# Altium schematic sheet Actuators.SchDoc
size A2; SheetNumber: 3; SheetTotal: 4
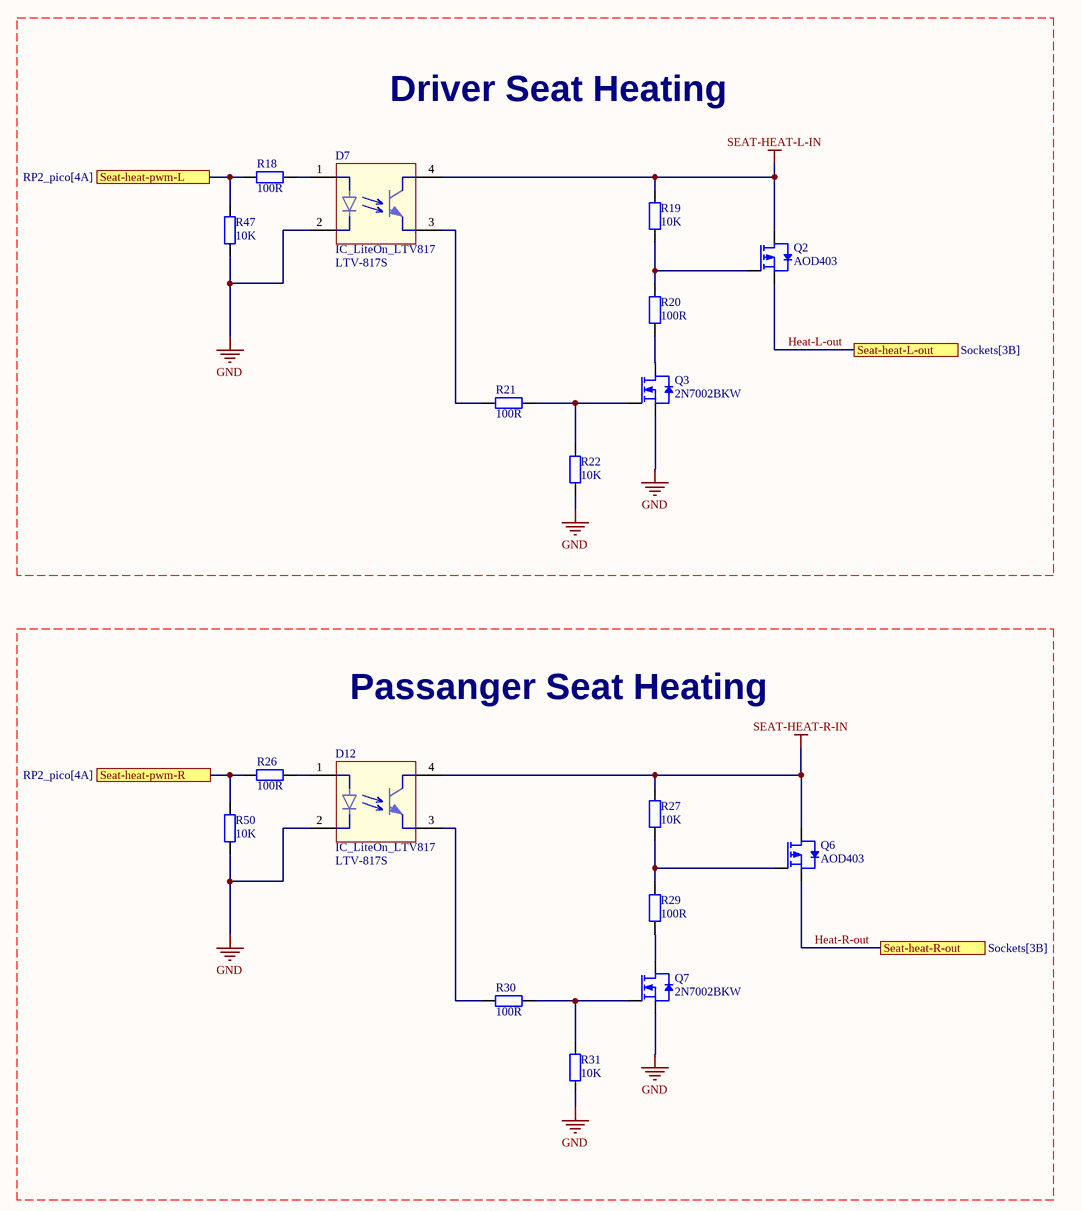
[diagram p0: Actuators.SchDoc, left]
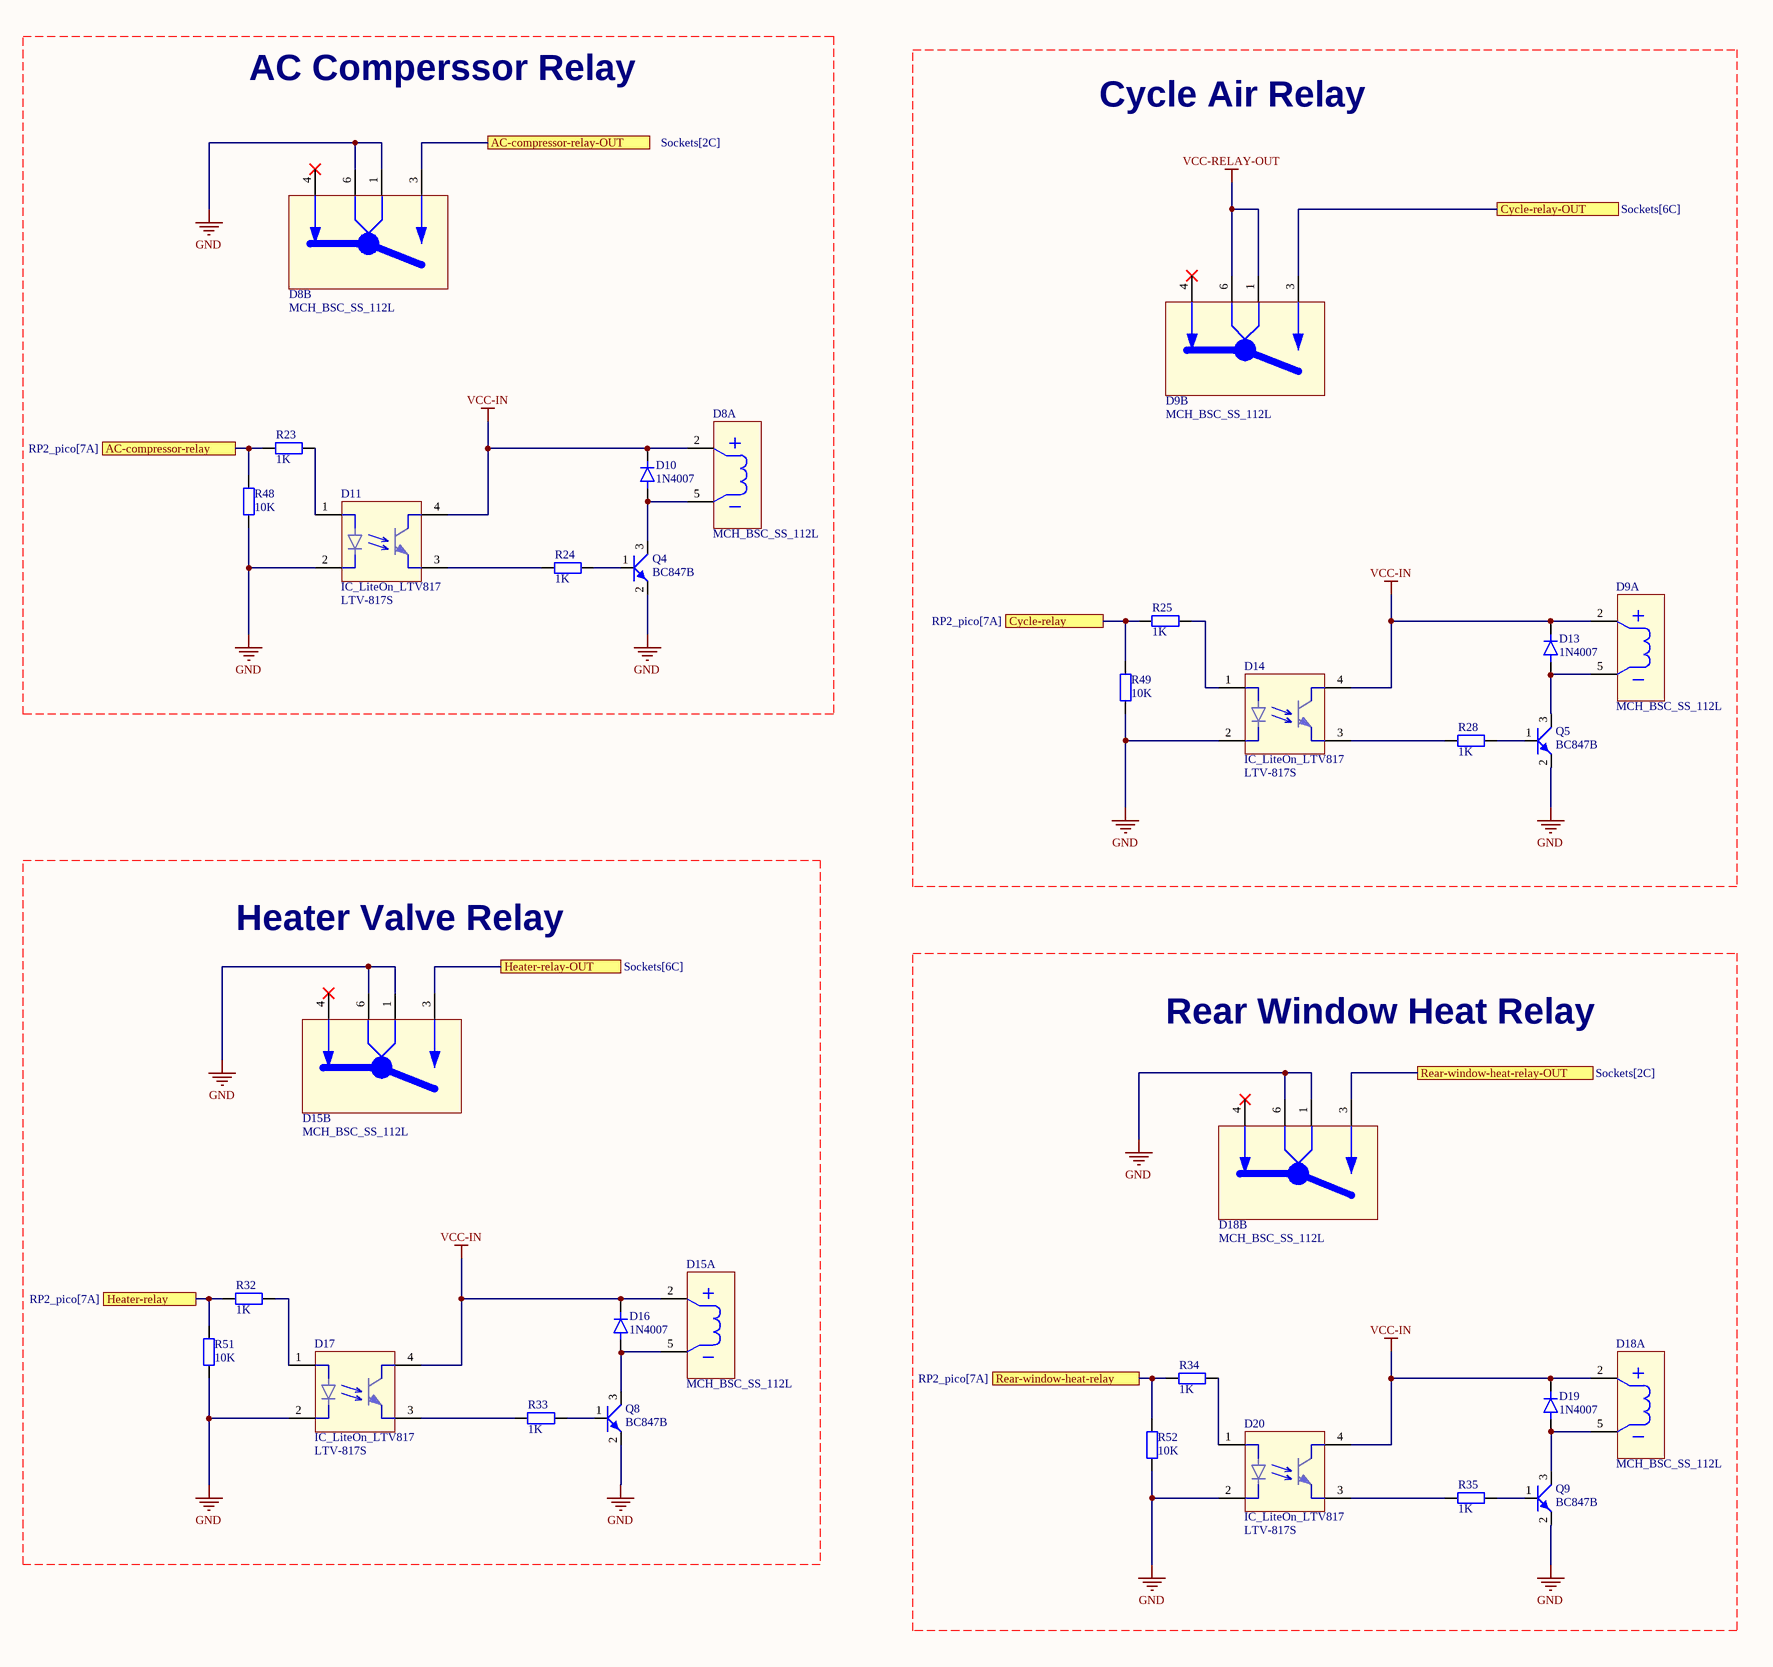
[diagram p1: Actuators.SchDoc, right]

## Parts
D7  IC_LiteOn_LTV817  Value1: LTV-817S  [IC_LiteOn_ LTV-817S]
D8  MCH_BSC_SS_112L  [MCH_BSC_SS_112L]  (parts A,B of 2)
D9  MCH_BSC_SS_112L  [MCH_BSC_SS_112L]  (parts A,B of 2)
D10  Value1: 1N4007  [DO-214AC]  (hidden comment: DIO)
D11  IC_LiteOn_LTV817  Value1: LTV-817S  [IC_LiteOn_ LTV-817S]
D12  IC_LiteOn_LTV817  Value1: LTV-817S  [IC_LiteOn_ LTV-817S]
D13  Value1: 1N4007  [DO-214AC]  (hidden comment: DIO)
D14  IC_LiteOn_LTV817  Value1: LTV-817S  [IC_LiteOn_ LTV-817S]
D15  MCH_BSC_SS_112L  [MCH_BSC_SS_112L]  (parts A,B of 2)
D16  Value1: 1N4007  [DO-214AC]  (hidden comment: DIO)
D17  IC_LiteOn_LTV817  Value1: LTV-817S  [IC_LiteOn_ LTV-817S]
D18  MCH_BSC_SS_112L  [MCH_BSC_SS_112L]  (parts A,B of 2)
D19  Value1: 1N4007  [DO-214AC]  (hidden comment: DIO)
D20  IC_LiteOn_LTV817  Value1: LTV-817S  [IC_LiteOn_ LTV-817S]
Q2  Value1: AOD403  [TO-252]  (hidden comment: TRS_FETP_123)
Q3  Value1: 2N7002BKW  [SOT65P210X110-3N]  (hidden comment: TRS_FETN_123)
Q4  Value1: BC847B  [SOT23]  (hidden comment: TRS_NPN_123)
Q5  Value1: BC847B  [SOT23]  (hidden comment: TRS_NPN_123)
Q6  Value1: AOD403  [TO-252]  (hidden comment: TRS_FETP_123)
Q7  Value1: 2N7002BKW  [SOT65P210X110-3N]  (hidden comment: TRS_FETN_123)
Q8  Value1: BC847B  [SOT23]  (hidden comment: TRS_NPN_123)
Q9  Value1: BC847B  [SOT23]  (hidden comment: TRS_NPN_123)
R18  Value1: 100R  [RESC2012X60N]  (hidden comment: RES)
R19  Value1: 10K  [RESC2012X60N]  (hidden comment: RES)
R20  Value1: 100R  [RESC2012X60N]  (hidden comment: RES)
R21  Value1: 100R  [RESC2012X60N]  (hidden comment: RES)
R22  Value1: 10K  [RESC2012X60N]  (hidden comment: RES)
R23  Value1: 1K  [RESC2012X60N]  (hidden comment: RES)
R24  Value1: 1K  [RESC2012X60N]  (hidden comment: RES)
R25  Value1: 1K  [RESC2012X60N]  (hidden comment: RES)
R26  Value1: 100R  [RESC2012X60N]  (hidden comment: RES)
R27  Value1: 10K  [RESC2012X60N]  (hidden comment: RES)
R28  Value1: 1K  [RESC2012X60N]  (hidden comment: RES)
R29  Value1: 100R  [RESC2012X60N]  (hidden comment: RES)
R30  Value1: 100R  [RESC2012X60N]  (hidden comment: RES)
R31  Value1: 10K  [RESC2012X60N]  (hidden comment: RES)
R32  Value1: 1K  [RESC2012X60N]  (hidden comment: RES)
R33  Value1: 1K  [RESC2012X60N]  (hidden comment: RES)
R34  Value1: 1K  [RESC2012X60N]  (hidden comment: RES)
R35  Value1: 1K  [RESC2012X60N]  (hidden comment: RES)
R47  Value1: 10K  [RESC2012X60N]  (hidden comment: RES)
R48  Value1: 10K  [RESC2012X60N]  (hidden comment: RES)
R49  Value1: 10K  [RESC2012X60N]  (hidden comment: RES)
R50  Value1: 10K  [RESC2012X60N]  (hidden comment: RES)
R51  Value1: 10K  [RESC2012X60N]  (hidden comment: RES)
R52  Value1: 10K  [RESC2012X60N]  (hidden comment: RES)

## Ports
AC-compressor-relay (see RP2_pico[7A]), AC-compressor-relay-OUT (see Sockets[2C]), Cycle-relay (see RP2_pico[7A]), Cycle-relay-OUT (see Sockets[6C]), Heater-relay (see RP2_pico[7A]), Heater-relay-OUT (see Sockets[6C]), Rear-window-heat-relay (see RP2_pico[7A]), Rear-window-heat-relay-OUT (see Sockets[2C]), Seat-heat-L-out (see Sockets[3B]), Seat-heat-pwm-L (see RP2_pico[4A]), Seat-heat-pwm-R (see RP2_pico[4A]), Seat-heat-R-out (see Sockets[3B])

## Nets
GND: D7.2 D8.1 D8.6 D11.2 D12.2 D14.2 D15.1 D15.6 D17.2 D18.1 D18.6 D20.2 Q3.2(S) Q4.2(E) Q5.2(E) Q7.2(S) Q8.2(E) Q9.2(E) R22.1 R31.1 R47.2 R48.2 R49.2 R50.2 R51.2 R52.2
SEAT-HEAT-L-IN: D7.4 Q2.3(D) R19.1
SEAT-HEAT-R-IN: D12.4 Q6.3(D) R27.1
VCC-IN: D8.2 D9.2 D10.2(K) D11.4 D13.2(K) D14.4 D15.2 D16.2(K) D17.4 D18.2 D19.2(K) D20.4
VCC-RELAY-OUT: D9.1 D9.6
AC-compressor-relay: R23.2 R48.1 ; port AC-compressor-relay
AC-compressor-relay-OUT: D8.3 ; port AC-compressor-relay-OUT
Cycle-relay: R25.2 R49.1 ; port Cycle-relay
Cycle-relay-OUT: D9.3 ; port Cycle-relay-OUT
Heat-L-out: Q2.2(S) ; port Seat-heat-L-out
Heat-R-out: Q6.2(S) ; port Seat-heat-R-out
Heater-relay: R32.2 R51.1 ; port Heater-relay
Heater-relay-OUT: D15.3 ; port Heater-relay-OUT
Rear-window-heat-relay: R34.2 R52.1 ; port Rear-window-heat-relay
Rear-window-heat-relay-OUT: D18.3 ; port Rear-window-heat-relay-OUT
Seat-heat-pwm-L: R18.1 R47.1 ; port Seat-heat-pwm-L
Seat-heat-pwm-R: R26.1 R50.1 ; port Seat-heat-pwm-R
NetD7_1: D7.1 R18.2
NetD7_3: D7.3 R21.1
NetD8_5: D8.5 D10.1(A) Q4.3(C)
NetD9_5: D9.5 D13.1(A) Q5.3(C)
NetD11_1: D11.1 R23.1
NetD11_3: D11.3 R24.2
NetD12_1: D12.1 R26.2
NetD12_3: D12.3 R30.2
NetD14_1: D14.1 R25.1
NetD14_3: D14.3 R28.2
NetD15_5: D15.5 D16.1(A) Q8.3(C)
NetD17_1: D17.1 R32.1
NetD17_3: D17.3 R33.2
NetD18_5: D18.5 D19.1(A) Q9.3(C)
NetD20_1: D20.1 R34.1
NetD20_3: D20.3 R35.2
NetQ2_1: Q2.1(G) R19.2 R20.2
NetQ3_1: Q3.1(G) R21.2 R22.2
NetQ3_3: Q3.3(D) R20.1
NetQ4_1: Q4.1(B) R24.1
NetQ5_1: Q5.1(B) R28.1
NetQ6_1: Q6.1(G) R27.2 R29.2
NetQ7_1: Q7.1(G) R30.1 R31.2
NetQ7_3: Q7.3(D) R29.1
NetQ8_1: Q8.1(B) R33.1
NetQ9_1: Q9.1(B) R35.1

Not connected (* = marked no-connect by the designer): D8 4*; D9 4*; D15 4*; D18 4*

## Notes on the sheet
- AC Comperssor Relay
- Cycle Air Relay
- Driver Seat Heating
- Passanger Seat Heating
- Heater Valve Relay
- Rear Window Heat Relay

## Library data of the parts
D7 D11 D12 D14 D17 D20 = 07_00275: Transistor Output Optocouplers Optocoupler Phototrans; Manufacturer: Lite-On; AutoId: 276; Id: 07_00275; Value2: Optocouplers; Value3: Optocouplers; Manufacturer PN: LTV-817S; DeviceType: Optocouple; Status: 0 - Unchecked; MountType: SMT; ComponentLink1Description: Datasheet; ComponentLink1URL: X:\01_Datasheets\IC_Lite_On_LTV-817S.pdf; ComponentLink2Description: ComponentVerificationSheet; ComponentLink2URL: X:\02_ComponentVerificationSheets\; Supplier 1: Mouser; Supplier Part Number 1: 859-LTV-817S
D8 D9 D15 D18 = 09_0010: Small relay 6 pins 12V, 2A; Manufacturer: KJS; AutoId: 10; Id: 09_0010; Value1: n/a; Value2: n/a; ComponentLink1Description: Datasheet; ComponentLink1URL: X:\01_Datasheets\MCH_BSC_SS_112L.pdf; ComponentLink2Description: ComponentVerificationSheet; ComponentLink2URL: X:\02_ComponentVerificationSheets\
D10 D13 D16 D19 = 03_00099: M7 Diode, max 30A; AutoId: 117; Value2: 1A, 400V; Id: 03_00099; Value3: M7; Manufacturer PN: 1N4007; DeviceType: diode; ComponentLink1Description: Datasheet; ComponentLink1URL: X:\01_Datasheets\; ComponentLink2Description: ComponentVerificationSheet; ComponentLink2URL: X:\02_ComponentVerificationSheets\
Q2 Q6 = 19_00048: 30V P-Channel MOSFET; Manufacturer: Alpha & Omega; AutoId: 54; Value2: 30V, 70A; DeviceType: transistor; SubType: P MOSFET; Id: 19_00048; Manufacturer PN: AOD403; Status: 0 - Unchecked; MountType: SMT; ComponentLink1Description: Datasheet; ComponentLink1URL: X:\01_Datasheets\AOD403.pdf; ComponentLink2Description: ComponentVerificationSheet; ComponentLink2URL: X:\02_ComponentVerificationSheets\
Q3 Q7 = 19_00024: NXP - 2N7002BKW - MOSFET, N CH, 60V, 0.31A, SOT323; AutoId: 24; DeviceType: transistor; Id: 19_00024; Value2: n/a; Manufacturer: NXP; Manufacturer PN: 2N7002BKW; SubType: MOSFET; Status: 2 - Checked and Approved; MountType: SMD; ComponentLink1Description: Datasheet; ComponentLink1URL: X:\01_dataSheets\TRS_NXP_2N7002BKW.pdf; ComponentLink2Description: ComponentVerificationSheet; ComponentLink2URL: X:\02_ComponentVerificationSheets\; Supplier 1: Farnell; Supplier Part Number 1: 1894713RL
Q4 Q5 Q8 Q9 = 19_00039: Bipolar Transistors - BJT NPN 45V 100mA; Manufacturer: NXP; Manufacturer PN: BC847B,215; AutoId: 39; Value2: 45V 0,1A; Id: 19_00039; DeviceType: transistor; SubType: NPN; Status: 0 - Unchecked; MountType: SMD; ComponentLink1Description: Datasheet; ComponentLink1URL: X:\01_Datasheets\TRS_NXP_BC847.pdf; ComponentLink2Description: ComponentVerificationSheet; ComponentLink2URL: X:\02_ComponentVerificationSheets\; Supplier 1: Mouser; Supplier Part Number 1: 771-BC847B-T/R
R18 R20 R21 R26 R29 R30 = 15_00317: RESISTOR, 0805, 100R, 1%, SMD; Manufacturer: Yageo; Manufacturer PN: RC0805FR-07100R; AutoId: 317; Value2: 0W125; SubType: Metal film; Id: 15_00317; DeviceType: resistor; Status: 2 - Checked and Approved; MountType: SMT; ComponentLink1Description: Datasheet; ComponentLink1URL: X:\01_Datasheets\RES_YAGEO_RC0805FR.pdf; Supplier 1: Farnell; Supplier Part Number 1: 9237364
R19 R22 R27 R31 R47-R52 = 15_00341: RESISTOR, 0805, 10K, 1%, SMD; Manufacturer: Yageo; Manufacturer PN: RC0805FR-0710K; AutoId: 341; Value2: 0W125; SubType: Metal film; Id: 15_00341; DeviceType: resistor; Status: 0 - Unchecked; MountType: SMT; ComponentLink1Description: Datasheet; ComponentLink1URL: X:\01_Datasheets\RES_YAGEO_RC0805FR.pdf; Supplier 1: Farnell
R23-R25 R28 R32-R35 = 15_00329: RESISTOR, 0805, 1K, 1%, SMD; Manufacturer: Yageo; Manufacturer PN: RC0805FR-071K; AutoId: 329; Value2: 0W125; SubType: Metal film; Id: 15_00329; DeviceType: resistor; Status: 2 - Checked and Approved; MountType: SMT; ComponentLink1Description: Datasheet; ComponentLink1URL: X:\01_Datasheets\RES_YAGEO_RC0805FR.pdf; Supplier 1: Farnell; Supplier Part Number 1: 9237496